# Altium project STC8G_Nano.PrjPcb
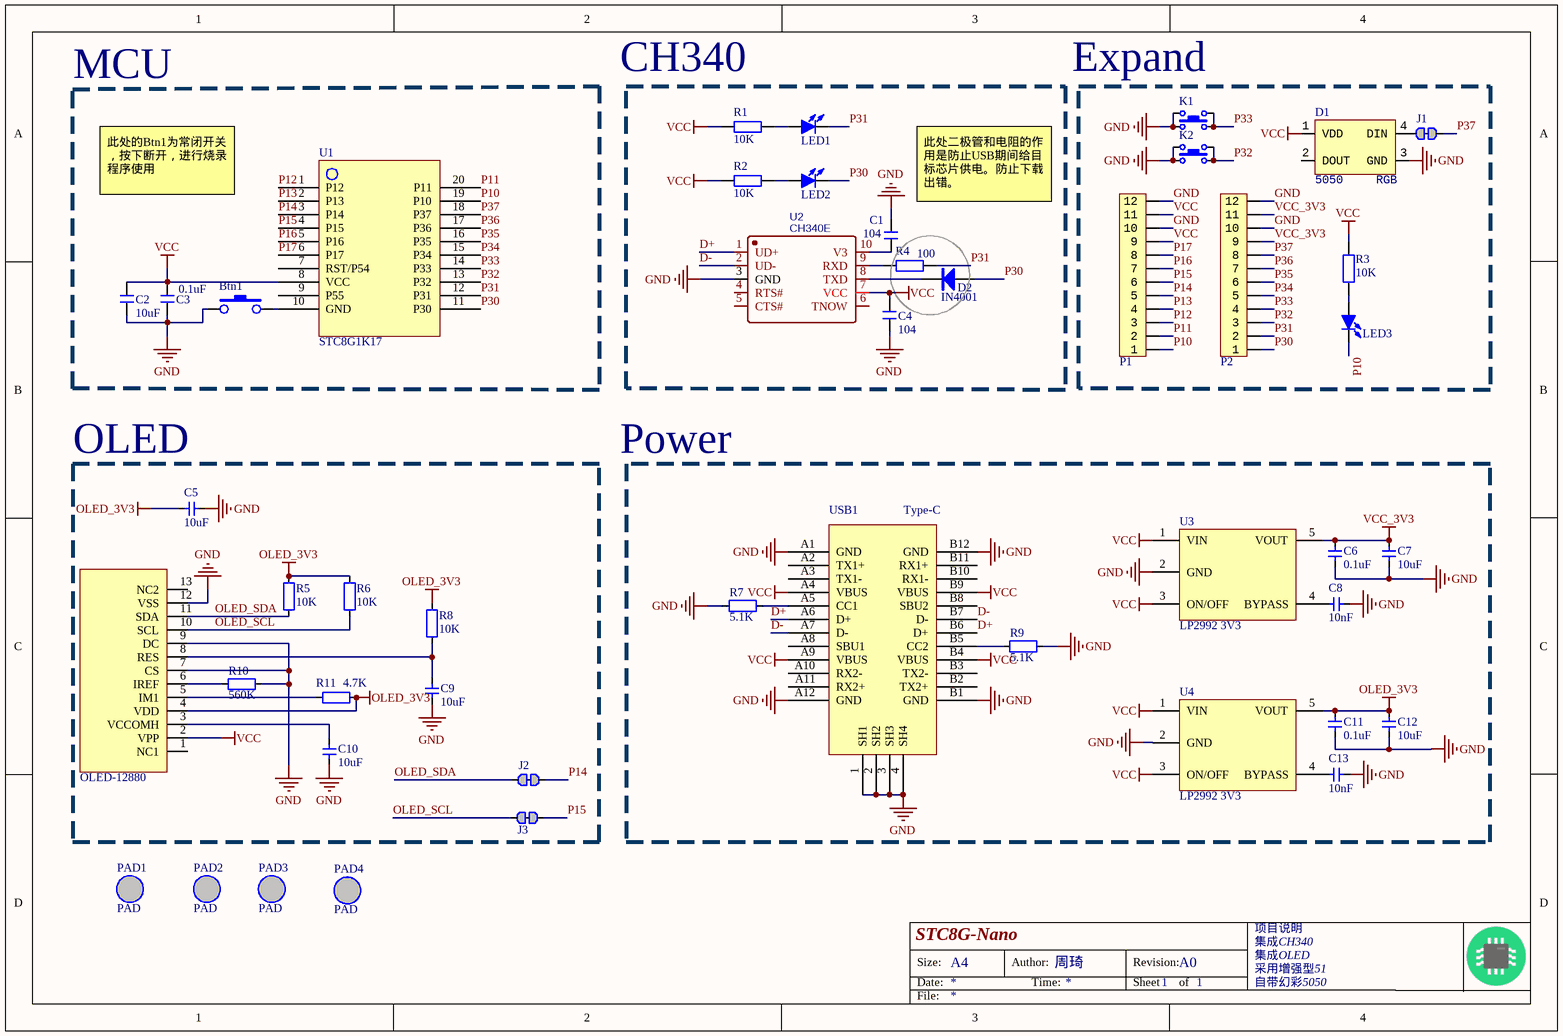
[diagram p0: Main.SchDoc]
1 sheet, 47 parts. Net scope: global (net labels, ports and power ports of the same name join across sheets).
Board file: PCB.PcbDoc

## Sheet Main.SchDoc: STC8G-Nano
size A4; Author: 周琦; Organization: 项目说明; Address1: 集成CH340; Address2: 集成OLED; Address3: 采用增强型51; Address4: 自带幻彩5050; Revision: A0; SheetNumber: 1; SheetTotal: 1

### Parts
1  OLED-12880  [OLED-12880]
Btn1  KEY  [TSW SMD-3*6*2.5]  (value not drawn)
C1  104  [C0402_L]
C2  10uF  [C0402_L]
C3  0.1uF  [C0402_L]
C4  104  [C0402_L]
C5  10uF  [CAP_0402]
C6  0.1uF  [CAP_0402]
C7  10uF  [CAP_0402]
C8  10nF  [CAP_0402]
C9  10uF  [CAP_0402]
C10  10uF  [CAP_0402]
C11  0.1uF  [CAP_0402]
C12  10uF  [CAP_0402]
C13  10nF  [CAP_0402]
D1  Type: 5050  [LED_5050_WS2812B]  (hidden comment: RGB)
D2  IN4001  [SOD-323]
J1  跳线  [RES_0402]  (value not drawn)
J2  跳线  [RES_0402]  (value not drawn)
J3  跳线  [RES_0402]  (value not drawn)
K1  TACT 4P  [ButtonTACT_3.5*3.55_90]  (value not drawn)
K2  TACT 4P  [ButtonTACT_3.5*3.55_90]  (value not drawn)
LED1  红色  [LED0603_B]  (value not drawn)
LED2  红色  [LED0603_B]  (value not drawn)
LED3  红色  [LED0603_B]  (value not drawn)
P1  HDR1x12_2.54  [HDR2.54-LI-12P]  (value not drawn)
P2  HDR1x12_2.54  [HDR2.54-LI-12P]  (value not drawn)
PAD1  PAD  [M2]
PAD2  PAD  [M2]
PAD3  PAD  [M2]
PAD4  PAD  [M2]
R1  10K  [RES_0402]
R2  10K  [RES_0402]
R3  10K  [RES_0402]
R4  100  [RES_0402]
R5  10K  [RES_0402]
R6  10K  [RES_0402]
R7  5.1K  [RES_0402]
R8  10K  [RES_0402]
R9  5.1K  [RES_0402]
R10  560K  [RES_0402]
R11  4.7K  [RES_0402]
U1  STC8G1K17  [TSSOP20_L]
U2  CH340E  [MSOP10_M]
U3  LP2992 3V3  [SOT23-5]
U4  LP2992 3V3  [SOT23-5]
USB1  Type-C  [USB-C-SMD_16P]

### Blocks framed on the sheet
MCU: Btn1 C2 C3 U1
OLED: 1 C5 C9 C10 J2 J3 R5 R6 R8 R10 R11

### Nets
GND: 1.7(CS) 1.9(DC) 1.12(VSS) Btn1.1 C1.1 C2.1 C3.1 C4.2 C5.1 C6.1 C7.1 C8.1 C9.1 C10.1 C11.1 C12.1 C13.1 D1.3(GND) K1.1 K1.3 K2.1 K2.3 P1.10 P1.12 P2.10 P2.12 R7.1 R9.1 R10.2 U2.3(GND) U3.2(GND) U4.2(GND) USB1.1(SH1) USB1.2(SH2) USB1.3(SH3) USB1.4(SH4) USB1.A1(GND) USB1.A12(GND) USB1.B1(GND) USB1.B12(GND)
OLED_3V3: 1.4(VDD) C5.2 C11.2 C12.2 R5.2 R6.2 R8.2 R11.2 U4.5(VOUT)
VCC: 1.2(VPP) C2.2 C3.2 C4.1 D1.1(VDD) P1.9 P1.11 R1.2 R2.2 R3.2 U1.8(VCC) U2.7(VCC) U3.1(VIN) U3.3(ON/OFF) U4.1(VIN) U4.3(ON/OFF) USB1.A4(VBUS) USB1.A9(VBUS) USB1.B4(VBUS) USB1.B9(VBUS)
VCC_3V3: C6.2 C7.2 P2.9 P2.11 U3.5(VOUT)
D+: U2.1(UD+) USB1.A6(D+) USB1.B6(D+)
D-: U2.2(UD-) USB1.A7(D-) USB1.B7(D-)
OLED_SCL: 1.10(SCL) J3.1 R6.1
OLED_SDA: 1.11(SDA) J2.1 R5.1
P10: LED3.2(K) P1.1 U1.19(P10)
P11: P1.2 U1.20(P11)
P12: P1.3 U1.1(P12)
P13: P1.4 U1.2(P13)
P14: J2.2 P1.5 U1.3(P14)
P15: J3.2 P1.6 U1.4(P15)
P16: P1.7 U1.5(P16)
P17: P1.8 U1.6(P17)
P30: D2.1(A) LED2.2(K) P2.1 U1.11(P30)
P31: LED1.2(K) P2.2 R4.1 U1.12(P31)
P32: K2.2 K2.4 P2.3 U1.13(P32)
P33: K1.2 K1.4 P2.4 U1.14(P33)
P34: P2.5 U1.15(P34)
P35: P2.6 U1.16(P35)
P36: P2.7 U1.17(P36)
P37: J1.2 P2.8 U1.18(P37)
Net1_3: 1.3(VCCOMH) C10.2
Net1_5: 1.5(IM1) R11.1
Net1_6: 1.6(IREF) R10.1
Net1_8: 1.8(RES) C9.2 R8.1
NetBtn1_2: Btn1.2 U1.10(GND)
NetC1_2: C1.2 U2.10(V3)
NetC8_2: C8.2 U3.4(BYPASS)
NetC13_2: C13.2 U4.4(BYPASS)
NetD1_4: D1.4(DIN) J1.1
NetD2_2: D2.2(K) U2.8(TXD)
NetLED1_1: LED1.1(A) R1.1
NetLED2_1: LED2.1(A) R2.1
NetLED3_1: LED3.1(A) R3.1
NetR4_2: R4.2 U2.9(RXD)
NetR7_2: R7.2 USB1.A5(CC1)
NetR9_2: R9.2 USB1.B5(CC2)

Not connected (* = marked no-connect by the designer): 1 1(NC1) 13(NC2); D1 2(DOUT); U1 7(RST/P54) 9(P55); U2 4(RTS#) 5(CTS#) 6(TNOW); USB1 A2(TX1+) A3(TX1-) A8(SBU1) A10(RX2-) A11(RX2+) B2(TX2+) B3(TX2-) B8(SBU2) B10(RX1-) B11(RX1+)

### Notes on the sheet
- (near R1) CH340
- (near K1) Expand
- 此处的Btn1为常闭开关，按下断开，进行烧录程序使用
- (near C1) 此处二极管和电阻的作用是防止USB期间给目标芯片供电。防止下载出错。
- Power
- Size:
- Date:
- A4
- Author:
- Time:
- Revision:
- Sheet
- of
- File:

### Library data of the parts
C1-C4 = C: 无极性贴片电容; 版权归属: 源创客; BOM名称: 无极性贴片电容; 学习资源: www.ooocke.com
C5-C13 = 电容-0402: Capacitor; Value: 0.1u
D1 = LED_5050_WS2812B: LED; Value: RGB
D2 = M7: 整流二极管; 版权归属: 源创客; BOM名称: 整流二极管; 学习资源: www.ooocke.com
J1-J3 = 跳线: Resistor; Published: 8-Jun-2000; LatestRevisionDate: 17-Jul-2002; LatestRevisionNote: Re-released for DXP Platform.; PackageReference: AXIAL-0.4; Publisher: Altium Limited; PackageDescription: Axial Device, Thru-Hole; 2 Leads; 0.4 in Pin Spacing
K1 K2 = ButtonTACT: Button; value: 3.4x3.5; type: TACT 4P
LED1-LED3 = LED-SMD: 贴片LED; 封装库来自淘宝卖家 ID：黄晶宝石: 其他店铺购入均为假冒，请立即申请退款，本店奖励现金5~20元; BOM名称: 贴片LED
P1 P2 = HDR1x12_2.54: Header
PAD1-PAD4 = PAD: M2通孔
R1-R4 = R-CRR: 直插色环电阻; BOM名称: 色环电阻; 版权归属: 源创客; 学习资源: www.ooocke.com
R5-R11 = 电阻-0402: Resistor; Value: 22R
U2 = CH340E: BOM_Manufacturer: WCH; subpart_no: 1; BOM_Supplier: LCSC; BOM_Manufacturer Part: CH340E; BOM_Supplier Part: C99652; BOM_JLCPCB Part Class: Extended Part; spicePre: U; spiceSymbolName: CH340E
U3 U4 = LP2992: LDO
USB1 = USB-Type-C-TOP